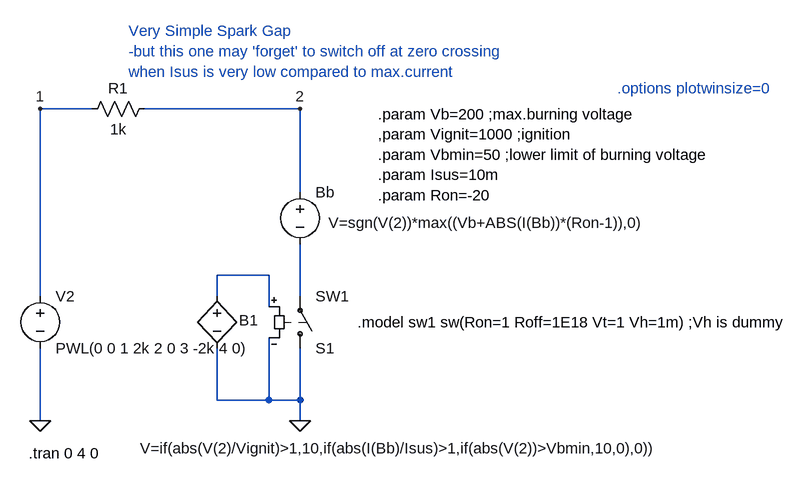
[diagram p0: schematic spark_gap_very_simple.asc]
spark_gap_very_simple.asc, the LTspice schematic file:
Version 4
SHEET 1 976 680
WIRE -336 224 -336 -64
WIRE -336 416 -336 304
WIRE -256 -64 -336 -64
WIRE -64 224 -64 192
WIRE -64 384 -64 304
WIRE 16 192 -64 192
WIRE 16 240 16 192
WIRE 16 384 -64 384
WIRE 16 384 16 288
WIRE 64 -64 -176 -64
WIRE 64 64 64 -64
WIRE 64 224 64 144
WIRE 64 384 16 384
WIRE 64 384 64 304
WIRE 64 416 64 384
FLAG 64 416 0
FLAG -336 416 0
FLAG 64 -64 2
FLAG -336 -64 1
SYMBOL sw 64 320 M180
SYMATTR InstName S1
SYMATTR Value SW1
SYMBOL voltage 64 48 R0
WINDOW 3 44 63 Left 0
SYMATTR Value V=sgn(V(2))*max((Vb+ABS(I(Bb))*(Ron-1)),0)
SYMATTR InstName Bb
SYMATTR Prefix B
SYMBOL voltage -336 208 R0
WINDOW 123 0 0 Left 0
WINDOW 39 0 0 Left 0
SYMATTR InstName V2
SYMATTR Value PWL(0 0 1 2k 2 0 3 -2k 4 0)
SYMBOL res -160 -80 R90
WINDOW 0 0 56 VBottom 0
WINDOW 3 32 56 VTop 0
SYMATTR InstName R1
SYMATTR Value 1k
SYMBOL bv -64 208 R0
WINDOW 0 34 53 Left 0
WINDOW 3 -118 250 Left 0
SYMATTR InstName B1
SYMATTR Value V=if(abs(V(2)/Vignit)>1,10,if(abs(I(Bb)/Isus)>1,if(abs(V(2))>Vbmin,10,0),0))
TEXT 152 264 Left 0 !.model sw1 sw(Ron=1 Roff=1E18 Vt=1 Vh=1m) ;Vh is dummy
TEXT 184 -56 Left 0 !.param Vb=200 ;max.burning voltage\n,param Vignit=1000 ;ignition\n.param Vbmin=50 ;lower limit of burning voltage\n.param Isus=10m\n.param Ron=-20
TEXT -354 466 Left 0 !.tran 0 4 0
TEXT -200 -184 Left 0 ;Very Simple Spark Gap\n-but this one may 'forget' to switch off at zero crossing\nwhen Isus is very low compared to max.current
TEXT 552 -96 Left 0 ;.options plotwinsize=0

The netlist it stands for:
* spark_gap_very_simple.asc
S1 0 N002 N001 0 SW1
Bb 2 N002 V=sgn(V(2))*max((Vb+ABS(I(Bb))*(Ron-1)),0)
V2 1 0 PWL(0 0 1 2k 2 0 3 -2k 4 0)
R1 2 1 1k
B1 N001 0 V=if(abs(V(2)/Vignit)>1,10,if(abs(I(Bb)/Isus)>1,if(abs(V(2))>Vbmin,10,0),0))
.model sw1 sw(Ron=1 Roff=1E18 Vt=1 Vh=1m) ;Vh is dummy
.param Vb=200 ;max.burning voltage
,param Vignit=1000 ;ignition
.param Vbmin=50 ;lower limit of burning voltage
.param Isus=10m
.param Ron=-20
.tran 0 4 0
* Very Simple Spark Gap
* -but this one may 'forget' to switch off at zero crossing
* when Isus is very low compared to max.current
* .options plotwinsize=0
.backanno
.end